# Altium schematic sheet 主流电机电路.SchDoc
size A4
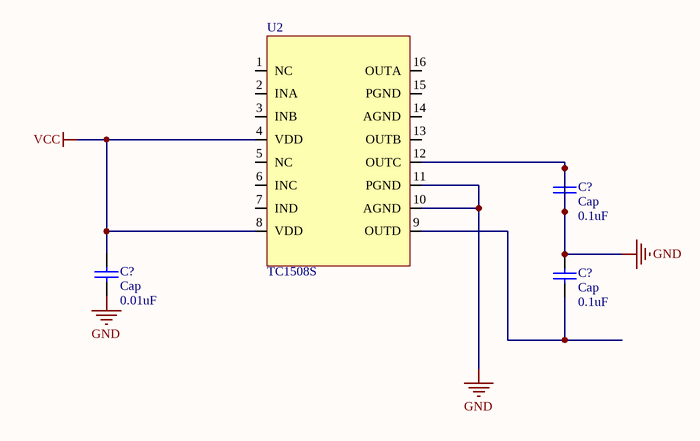
[diagram p0: 主流电机电路.SchDoc]

## Parts
(Parts that share a designator on the sheet are numbered #1, #2 ... from top to bottom, then left to right.)
C?#1  Cap  value 0.1uF  [RAD-0.3]
C?#2  Cap  value 0.01uF  [RAD-0.3]
C?#3  Cap  value 0.1uF  [RAD-0.3]
U2  TC1508S  [TC1508S]

## Nets
GND: C?#1.1 C?#1.2 C?#2.1 C?#3.2 U2.10(AGND) U2.11(PGND) U2.12(OUTC)
VCC: C?#2.2 U2.4(VDD) U2.8(VDD)
NetC?#3_1: C?#3.1 U2.9(OUTD)

Not connected (* = marked no-connect by the designer): U2 1(NC) 2(INA) 3(INB) 5(NC) 6(INC) 7(IND) 13(OUTB) 14(AGND) 15(PGND) 16(OUTA)

## Library data of the parts
C?#1-C?#3 = Cap: Capacitor; Published: 8-Jun-2000; LatestRevisionDate: 17-Jul-2002; LatestRevisionNote: Re-released for DXP Platform.; PackageReference: RAD-0.3; Publisher: Altium Limited; PackageDescription: Radial Cap, Thru-Hole; 2 Leads; 0.3 in Pin Spacing